# Altium project LEDHeart.PrjPCB
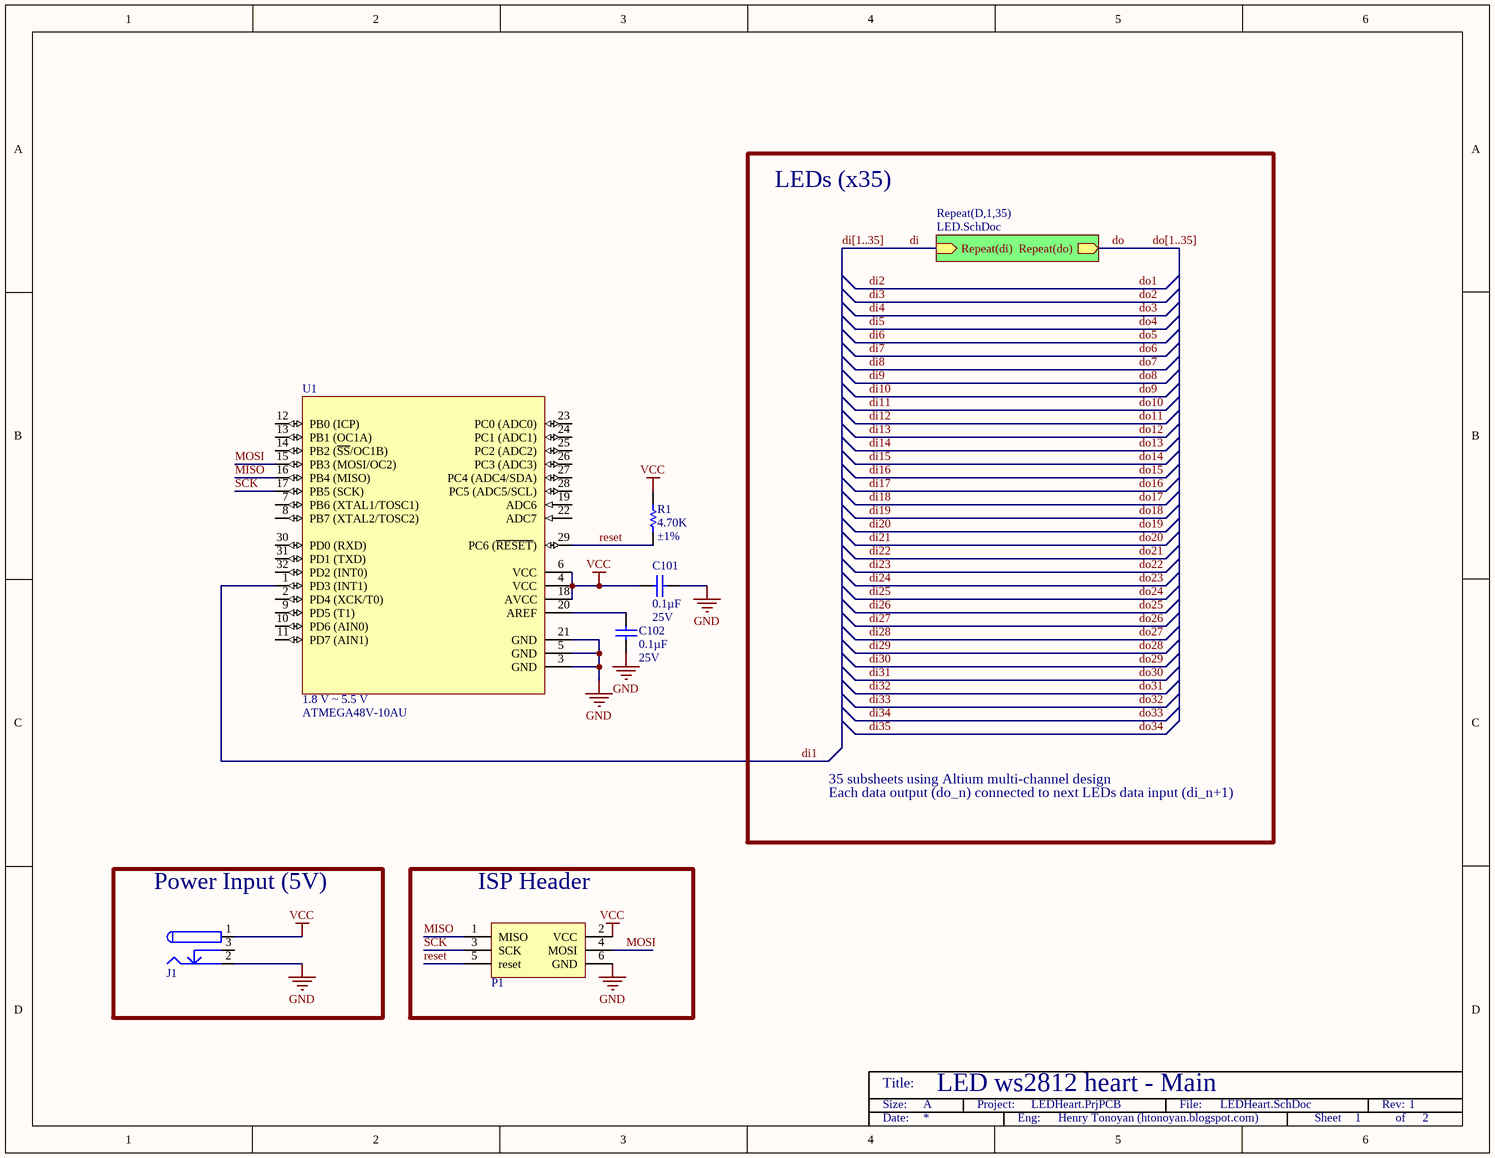
[diagram p0: LEDHeart.SchDoc]
2 sheets, 76 parts. Net scope: hierarchical (ports join the sheet entries above them; power ports are global).
Board file: heart.PcbDoc
Sheets:
  LEDHeart.SchDoc
    D1 = LED.SchDoc
    D2 = LED.SchDoc
    D3 = LED.SchDoc
    D4 = LED.SchDoc
    D5 = LED.SchDoc
    D6 = LED.SchDoc
    D7 = LED.SchDoc
    D8 = LED.SchDoc
    D9 = LED.SchDoc
    D10 = LED.SchDoc
    D11 = LED.SchDoc
    D12 = LED.SchDoc
    D13 = LED.SchDoc
    D14 = LED.SchDoc
    D15 = LED.SchDoc
    D16 = LED.SchDoc
    D17 = LED.SchDoc
    D18 = LED.SchDoc
    D19 = LED.SchDoc
    D20 = LED.SchDoc
    D21 = LED.SchDoc
    D22 = LED.SchDoc
    D23 = LED.SchDoc
    D24 = LED.SchDoc
    D25 = LED.SchDoc
    D26 = LED.SchDoc
    D27 = LED.SchDoc
    D28 = LED.SchDoc
    D29 = LED.SchDoc
    D30 = LED.SchDoc
    D31 = LED.SchDoc
    D32 = LED.SchDoc
    D33 = LED.SchDoc
    D34 = LED.SchDoc
    D35 = LED.SchDoc

## Sheet LEDHeart.SchDoc: LED ws2812 heart - Main
size 279 x 215 mm; Engineer: Henry Tonoyan (htonoyan.blogspot.com); Revision: 1; SheetNumber: 1; SheetTotal: 2

### Parts
C101  Capacitance: 0.1µF  Voltage - Rated: 25V  [0603]  (hidden comment: CAP CER .10UF 25V X7R 10% 0603)
C102  Capacitance: 0.1µF  Voltage - Rated: 25V  [0603]  (hidden comment: CAP CER .10UF 25V X7R 10% 0603)
J1  CONN_PWR2.0_SMT  [CONN_PWR2.0_SMT]  (value not drawn)
P1  Header, 3-Pin, Dual row  [CONN_HDR_SMT_6_2R]  (value not drawn)
R1  Resistance (Ohms): 4.70K  Tolerance: ±1%  [0603]  (hidden comment: RES_4.70K_OHM_1/10W_1%_0603_SMD)
U1  Voltage - Supply (Vcc/Vdd): 1.8 V ~ 5.5 V  Manufacturer Part Number: ATMEGA48V-10AU  [32A_N]  (hidden comment: IC_AVR_MCU_4K_10MHZ_1.8V_32TQFP)

### Blocks framed on the sheet
Power Input (5V): J1
ISP Header: P1

### Sub-sheets
Repeat(D,1,35) = LED.SchDoc: Repeat(di) (in), Repeat(do) (out)

### Nets
GND: C101.1 C102.1 J1.2 P1.6(GND) U1.3(GND) U1.5(GND) U1.21(GND)
VCC: C101.2 J1.1 P1.2(VCC) R1.2 U1.4(VCC) U1.6(VCC) U1.18(AVCC)
di: sheet Repeat(D,1,35)/Repeat(di)
di1: U1.1(PD3_(INT1))
do: sheet Repeat(D,1,35)/Repeat(do)
MISO: P1.1(MISO) U1.16(PB4_(MISO))
MOSI: P1.4(MOSI) U1.15(PB3_(MOSI/OC2))
reset: P1.5(reset) R1.1 U1.29(PC6_(~{RESET}))
SCK: P1.3(SCK) U1.17(PB5_(SCK))
NetC102_2: C102.2 U1.20(AREF)

Not connected (* = marked no-connect by the designer): J1 3; U1 2(PD4_(XCK/T0)) 7(PB6_(XTAL1/TOSC1)) 8(PB7_(XTAL2/TOSC2)) 9(PD5_(T1)) 10(PD6_(AIN0)) 11(PD7_(AIN1)) 12(PB0_(ICP)) 13(PB1_(OC1A)) 14(PB2_(~{SS}/OC1B)) 19(ADC6) 22(ADC7) 23(PC0_(ADC0)) 24(PC1_(ADC1)) 25(PC2_(ADC2)) 26(PC3_(ADC3)) 27(PC4_(ADC4/SDA)) 28(PC5_(ADC5/SCL)) 30(PD0_(RXD)) 31(PD1_(TXD)) 32(PD2_(INT0))

### Buses and harness runs
bus di[1..35]
bus do[1..35]

### Notes on the sheet
- LEDs (x35)
- 35 subsheets using Altium multi-channel design
- Each data output (do_n) connected to next LEDs data input (di_n+1)
- Title:
- Size:
- A
- Project:
- File:
- Rev:
- Date:
- Eng:
- Sheet
- of

### Library data of the parts
C101 C102 = CAP_CER_.10UF_25V_X7R_10%_0603_1: Manufacturer: TDK Corporation; Manufacturer Part Number: C1608X7R1E104K; Supplier 1: Digi-Key; RoHS: RoHS Compliant; Category: Capacitors; Stock 1: 1271235; Pricing 1: 1=0.1, 10=0.024, 100=0.011, 250=0.009, 500=0.0077, 1000=0.006 (USD); Tolerance: ±10%; Temperature Coefficient: X7R; Mounting Type: Surface Mount, MLCC; Operating Temperature: -55°C ~ 125°C; Applications: General Purpose; Ratings: -; Package / Case: 0603 (1608 Metric); Size / Dimension: 0.063" L x 0.031" W (1.60mm x 0.80mm); Height - Seated (Max): -; Thickness (Max): 0.037" (0.95mm); Lead Spacing: -; Features: -; Packaging: Cut Tape (CT); Lead Style: -; ComponentLink1URL: http://www.tdk.com/pdf/general_B11.pdf; ComponentLink1Description: Datasheet; Supplier Part Number 1: 445-1316-1-ND
J1 = CONN_PWR2.0_SMT: CONN PWR JACK 2.0X6.3MM SMT; Manufacturer: CUI Inc; Manufacturer Part Number: PJ-036A-SMT; Gender: Male; Plug/Mating Plug Diameter: 2.1mm ID, 5.5mm OD; Number of Positions/Contacts: 2 Conductors, 3 Contacts; Internal Switch(s): Single Switch, Normally Closed; Shielding: Unshielded; Voltage - Rated: 16VDC; Current Rating: 2.5A; Supplier 1: Digi-Key; RoHS: RoHS Compliant; Category: Connectors, Interconnects; Stock 1: 20300; Pricing 1: 1=1.67, 10=1.297, 100=0.9895 (USD); Connector Type: Jack; Mounting Type: Surface Mount, Right Angle; Termination: Solder; Features: -; Color: Black; Contact Material: Brass; Contact Material - Plating: Silver; Housing Color: Black; Housing Material: Thermoplastic; Operating Temperature: -25°C ~ 85°C; ComponentLink1URL: http://www.cui.com/Product/Resource/DigiKeyPDF/PJ-036A-SMT.pdf; ComponentLink1Description: Datasheet; Supplier Part Number 1: CP-036APJCT-ND
P1 = CONN_Header_0.100_6pos: Manufacturer: Molex Connector Corporation; Connector Type: Header, Unshrouded, Breakaway; Number of Positions: 6; Number of Positions Loaded: All; Pitch: 0.100" (2.54mm); Supplier 1: Digi-Key; Manufacturer Part Number: 15-91-2060; RoHS: RoHS Compliant; Category: Connectors, Interconnects; Stock 1: 2541; Pricing 1: 1=0.82, 10=0.576, 50=0.4442, 100=0.3866, 250=0.329, 500=0.31256, 1000=0.27965, 2500=0.22208, 5000=0.21879 (USD); Contact Type: Male Pin; Number of Rows: 2; Row Spacing: 0.100" (2.54mm); Contact Mating Length: 0.240" (6.10mm); Mounting Type: Surface Mount; Termination: Solder; Fastening Type: -; Features: -; Contact Finish: Tin; Contact Finish Thickness: 150µin (3.81µm); Color: Black; Packaging: Bulk; ComponentLink1URL: http://www.molex.com/pdm_docs/sd/015912060_sd.pdf; ComponentLink1Description: Datasheet; Supplier Part Number 1: WM17449-ND
R1 = RES_4.70K_OHM_1/10W_1%_0603_SMD: RES 4.70K OHM 1/10W 1% 0603 SMD; Manufacturer: Panasonic Electronic Components; Manufacturer Part Number: ERJ-3EKF4701V; Power (Watts): 0.1W, 1/10W; Temperature Coefficient: ±100ppm/°C; Supplier 1: Digi-Key; RoHS: RoHS Compliant; Category: Resistors; Stock 1: 955812; Pricing 1: 1=0.1, 50=0.0138, 100=0.0105, 250=0.0078, 500=0.00576, 1000=0.00384 (USD); Composition: Thick Film; Features: -; Package / Case: 0603 (1608 Metric); Size / Dimension: 0.063" L x 0.031" W (1.60mm x 0.80mm); Height: 0.022" (0.55mm); Number of Terminations: 2; Packaging: Cut Tape (CT); ComponentLink1URL: http://industrial.panasonic.com/www-cgi/jvcr13pz.cgi?E+PZ+3+AOA0002+ERJ3EKF4701V+7+WW; ComponentLink1Description: Datasheet; Supplier Part Number 1: P4.70KHCT-ND
U1 = IC_AVR_MCU_4K_10MHZ_1.8V_32TQFP_1: IC AVR MCU 4K 10MHZ 1.8V 32TQFP; Manufacturer: Atmel; Core Size: 8-Bit; Connectivity: I²C, SPI, UART/USART; Peripherals: Brown-out Detect/Reset, POR, PWM, WDT; Number of I /O: 23; Program Memory Size: 4KB (2K x 16); Program Memory Type: FLASH; EEPROM Size: 256 x 8; RAM Size: 512 x 8; Data Converters: A/D 8x10b; Oscillator Type: Internal; Supplier 1: Digi-Key; RoHS: RoHS Compliant; Category: Integrated Circuits (ICs); Stock 1: 15971; Pricing 1: 1=2.73, 25=1.7144, 100=1.524 (USD); Core Processor: AVR; Speed: 10MHz; Operating Temperature: -40°C ~ 85°C; Package / Case: 32-TQFP; Packaging: Tray; ComponentLink1Description: Datasheet; ComponentLink1URL: http://www.atmel.com/Images/2545s.pdf; Supplier Part Number 1: ATMEGA48V-10AU-ND

## Sheet LED.SchDoc: LED ws2812 Heart - LED
size 279 x 215 mm; Engineer: Henry Tonoyan (htonoyan.blogspot.com); Revision: 1; SheetNumber: 2; SheetTotal: 2
Used 35 times, as channels D1, D2, D3, D4, D5, D6, D7, D8, D9, D10, D11, D12, D13, D14, D15, D16, D17, D18, D19, D20, D21, D22, D23, D24, D25, D26, D27, D28, D29, D30, D31, D32, D33, D34, D35. Parts and nets are listed once, with the designators drawn on the sheet.
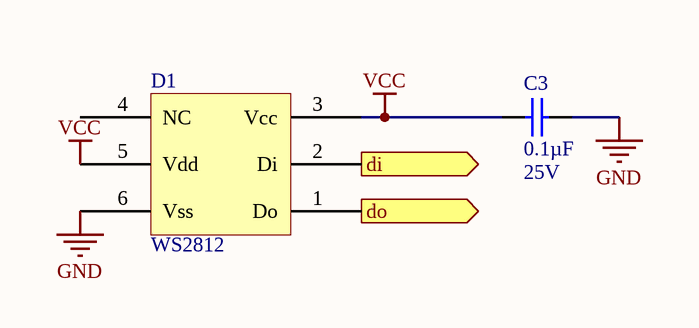
[diagram p1: LED.SchDoc]

### Parts
C3  Capacitance: 0.1µF  Voltage - Rated: 25V  [0603]  (hidden comment: CAP CER .10UF 25V X7R 10% 0603)
D1  WS2812  [LED_5050]

### Ports
di (in), do (out)

### Nets
GND: C3.2 D1.6(Vss)
VCC: C3.1 D1.3(Vcc) D1.5(Vdd)
di: D1.2(Di) ; port di
do: D1.1(Do) ; port do

Not connected (* = marked no-connect by the designer): D1 4(NC)

### Channels
D1: designators C3=C1 D1=D1; ports di=di1 do=di2
D2: designators C3=C2 D1=D2; ports di=di2 do=di3
D3: designators C3=C3 D1=D3; ports di=di3 do=di4
D4: designators C3=C4 D1=D4; ports di=di4 do=di5
D5: designators C3=C5 D1=D5; ports di=di5 do=di6
D6: designators C3=C6 D1=D6; ports di=di6 do=di7
D7: designators C3=C7 D1=D7; ports di=di7 do=di8
D8: designators C3=C8 D1=D8; ports di=di8 do=di9
D9: designators C3=C9 D1=D9; ports di=di9 do=di10
D10: designators C3=C10 D1=D10; ports di=di10 do=di11
D11: designators C3=C11 D1=D11; ports di=di11 do=di12
D12: designators C3=C12 D1=D12; ports di=di12 do=di13
D13: designators C3=C13 D1=D13; ports di=di13 do=di14
D14: designators C3=C14 D1=D14; ports di=di14 do=di15
D15: designators C3=C15 D1=D15; ports di=di15 do=di16
D16: designators C3=C16 D1=D16; ports di=di16 do=di17
D17: designators C3=C17 D1=D17; ports di=di17 do=di18
D18: designators C3=C18 D1=D18; ports di=di18 do=di19
D19: designators C3=C19 D1=D19; ports di=di19 do=di20
D20: designators C3=C20 D1=D20; ports di=di20 do=di21
D21: designators C3=C21 D1=D21; ports di=di21 do=di22
D22: designators C3=C22 D1=D22; ports di=di22 do=di23
D23: designators C3=C23 D1=D23; ports di=di23 do=di24
D24: designators C3=C24 D1=D24; ports di=di24 do=di25
D25: designators C3=C25 D1=D25; ports di=di25 do=di26
D26: designators C3=C26 D1=D26; ports di=di26 do=di27
D27: designators C3=C27 D1=D27; ports di=di27 do=di28
D28: designators C3=C28 D1=D28; ports di=di28 do=di29
D29: designators C3=C29 D1=D29; ports di=di29 do=di30
D30: designators C3=C30 D1=D30; ports di=di30 do=di31
D31: designators C3=C31 D1=D31; ports di=di31 do=di32
D32: designators C3=C32 D1=D32; ports di=di32 do=di33
D33: designators C3=C33 D1=D33; ports di=di33 do=di34
D34: designators C3=C34 D1=D34; ports di=di34 do=di35
D35: designators C3=C35 D1=D35; ports di=di35 do=do35

### Notes on the sheet
- Title:
- Size:
- A
- Project:
- File:
- Rev:
- Date:
- Eng:
- Sheet
- of

### Library data of the parts
C3 = CAP_CER_.10UF_25V_X7R_10%_0603_1: as C101 on sheet LEDHeart; Supplier 1: Digi-Key; RoHS: RoHS Compliant; Category: Capacitors; Stock 1: 1271235; Pricing 1: 1=0.1, 10=0.024, 100=0.011, 250=0.009, 500=0.0077, 1000=0.006 (USD); Tolerance: ±10%; Temperature Coefficient: X7R; Mounting Type: Surface Mount, MLCC; Operating Temperature: -55°C ~ 125°C; Applications: General Purpose; Ratings: -; Package / Case: 0603 (1608 Metric); Size / Dimension: 0.063" L x 0.031" W (1.60mm x 0.80mm); Height - Seated (Max): -; Thickness (Max): 0.037" (0.95mm); Lead Spacing: -; Features: -; Packaging: Cut Tape (CT); Lead Style: -; ComponentLink1URL: http://www.tdk.com/pdf/general_B11.pdf; ComponentLink1Description: Datasheet; Supplier Part Number 1: 445-1316-1-ND

## Nets that join several sheets
GND: LEDHeart (7 pins), D1 (C1.2 D1.6), D2 (C2.2 D2.6), D3 (C3.2 D3.6), D4 (C4.2 D4.6), D5 (C5.2 D5.6), D6 (C6.2 D6.6), D7 (C7.2 D7.6), D8 (C8.2 D8.6), D9 (C9.2 D9.6), D10 (C10.2 D10.6), D11 (C11.2 D11.6), D12 (C12.2 D12.6), D13 (C13.2 D13.6), D14 (C14.2 D14.6), D15 (C15.2 D15.6), D16 (C16.2 D16.6), D17 (C17.2 D17.6), D18 (C18.2 D18.6), D19 (C19.2 D19.6), D20 (C20.2 D20.6), D21 (C21.2 D21.6), D22 (C22.2 D22.6), D23 (C23.2 D23.6), D24 (C24.2 D24.6), D25 (C25.2 D25.6), D26 (C26.2 D26.6), D27 (C27.2 D27.6), D28 (C28.2 D28.6), D29 (C29.2 D29.6), D30 (C30.2 D30.6), D31 (C31.2 D31.6), D32 (C32.2 D32.6), D33 (C33.2 D33.6), D34 (C34.2 D34.6), D35 (C35.2 D35.6)
VCC: LEDHeart (7 pins), D1 (C1.1 D1.3 D1.5), D2 (C2.1 D2.3 D2.5), D3 (C3.1 D3.3 D3.5), D4 (C4.1 D4.3 D4.5), D5 (C5.1 D5.3 D5.5), D6 (C6.1 D6.3 D6.5), D7 (C7.1 D7.3 D7.5), D8 (C8.1 D8.3 D8.5), D9 (C9.1 D9.3 D9.5), D10 (C10.1 D10.3 D10.5), D11 (C11.1 D11.3 D11.5), D12 (C12.1 D12.3 D12.5), D13 (C13.1 D13.3 D13.5), D14 (C14.1 D14.3 D14.5), D15 (C15.1 D15.3 D15.5), D16 (C16.1 D16.3 D16.5), D17 (C17.1 D17.3 D17.5), D18 (C18.1 D18.3 D18.5), D19 (C19.1 D19.3 D19.5), D20 (C20.1 D20.3 D20.5), D21 (C21.1 D21.3 D21.5), D22 (C22.1 D22.3 D22.5), D23 (C23.1 D23.3 D23.5), D24 (C24.1 D24.3 D24.5), D25 (C25.1 D25.3 D25.5), D26 (C26.1 D26.3 D26.5), D27 (C27.1 D27.3 D27.5), D28 (C28.1 D28.3 D28.5), D29 (C29.1 D29.3 D29.5), D30 (C30.1 D30.3 D30.5), D31 (C31.1 D31.3 D31.5), D32 (C32.1 D32.3 D32.5), D33 (C33.1 D33.3 D33.5), D34 (C34.1 D34.3 D34.5), D35 (C35.1 D35.3 D35.5)
di1: LEDHeart (U1.1), D1 (D1.2)
di2: D1 (D1.1), D2 (D2.2)
di3: D2 (D2.1), D3 (D3.2)
di4: D3 (D3.1), D4 (D4.2)
di5: D4 (D4.1), D5 (D5.2)
di6: D5 (D5.1), D6 (D6.2)
di7: D6 (D6.1), D7 (D7.2)
di8: D7 (D7.1), D8 (D8.2)
di9: D8 (D8.1), D9 (D9.2)
di10: D9 (D9.1), D10 (D10.2)
di11: D10 (D10.1), D11 (D11.2)
di12: D11 (D11.1), D12 (D12.2)
di13: D12 (D12.1), D13 (D13.2)
di14: D13 (D13.1), D14 (D14.2)
di15: D14 (D14.1), D15 (D15.2)
di16: D15 (D15.1), D16 (D16.2)
di17: D16 (D16.1), D17 (D17.2)
di18: D17 (D17.1), D18 (D18.2)
di19: D18 (D18.1), D19 (D19.2)
di20: D19 (D19.1), D20 (D20.2)
di21: D20 (D20.1), D21 (D21.2)
di22: D21 (D21.1), D22 (D22.2)
di23: D22 (D22.1), D23 (D23.2)
di24: D23 (D23.1), D24 (D24.2)
di25: D24 (D24.1), D25 (D25.2)
di26: D25 (D25.1), D26 (D26.2)
di27: D26 (D26.1), D27 (D27.2)
di28: D27 (D27.1), D28 (D28.2)
di29: D28 (D28.1), D29 (D29.2)
di30: D29 (D29.1), D30 (D30.2)
di31: D30 (D30.1), D31 (D31.2)
di32: D31 (D31.1), D32 (D32.2)
di33: D32 (D32.1), D33 (D33.2)
di34: D33 (D33.1), D34 (D34.2)
di35: D34 (D34.1), D35 (D35.2)